# EAGLE design board (EAGLE 9.1.3)
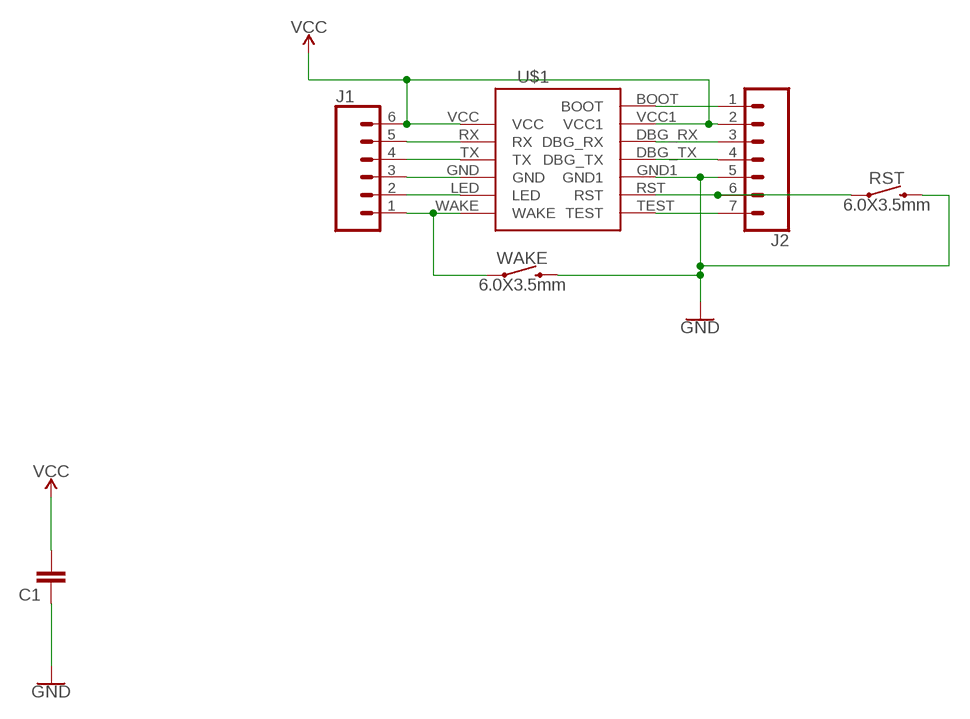
[diagram p0: schematic, sheet 1]

## Parts
C1  C-EUC0805  [C0805]
J1  CONN_06LOCK  [1X06_LOCK]
J2  CONN_07LOCK  [1X07_LOCK]
RST  6.0X3.5mm  MOMENTARY-SWITCH-SPST-SMD-6.0X3.5MM  [TACTILE_SWITCH_SMD_6.0X3.5MM]
U$1  IM-L400  [IM-L400]
WAKE  6.0X3.5mm  MOMENTARY-SWITCH-SPST-SMD-6.0X3.5MM  [TACTILE_SWITCH_SMD_6.0X3.5MM]

## Nets
GND [power]: C1.1 J1.3 J2.5 RST.2 U$1.GND U$1.GND1 WAKE.2
N$2: J1.5 U$1.RX
N$3: J1.4 U$1.TX
N$5: J1.2 U$1.LED
N$6: J1.1 U$1.WAKE WAKE.1
N$7: J2.1 U$1.BOOT
N$9: J2.3 U$1.DBG_RX
N$10: J2.4 U$1.DBG_TX
N$12: J2.6 RST.1 U$1.RST
N$13: J2.7 U$1.TEST
VCC [power]: C1.2 J1.6 J2.2 U$1.VCC U$1.VCC1

## Library data of the parts
C1 = rcl:C-EU: CAPACITOR, European symbol; SPICEPREFIX: C
J1 = SparkFun-Connectors:CONN_06: Multi connection point. Often used as Generic Header-pin footprint for 0.1 inch spaced/style header connections On any of the 0.1 inch spaced packages, you can populate with these: Break Away Headers - Straight <https://www.sparkfun.com/products/116> (PRT-00116) Break Away Male Headers - Right Angle <https://www.sparkfun.com/products/553> (PRT-00553) Female Headers <https://www.sparkfun.com/products/115> (PRT-00115) Break Away Headers - Machine Pin <https://www.sparkfun.com/products/117> (PRT-00117) Break Away Female Headers - Swiss Machine Pin <https://www.sparkfun.com/products/743> (PRT-00743) Arduino Stackable Header - 6 Pin <https://www.sparkfun.com/products/9280> (PRT-09280) For SCREWTERMINALS and SPRING TERMINALS visit here: Screw Terimnals on SparkFun.com <https://www.sparkfun.com/search/results?term=Screw+Terminals> (5mm/3.5mm/2.54mm spacing) This device is also useful as a general connection point to wire up your design to another part of your project. Our various solder wires solder well into these plated through hole pads. Hook-Up Wire - Assortment (Stranded, 22 AWG) <https://www.sparkfun.com/products/11375> (PRT-11375) Hook-Up Wire - Assortment (Solid Core, 22 AWG) <https://www.sparkfun.com/products/11367> (PRT-11367) View the entire wire category on our website here <https://www.sparkfun.com/categories/141>
J2 = SparkFun-Connectors:CONN_07: Multi connection point. Often used as Generic Header-pin footprint for 0.1 inch spaced/style header connections On any of the 0.1 inch spaced packages, you can populate with these: Break Away Headers - Straight <https://www.sparkfun.com/products/116> (PRT-00116) Break Away Male Headers - Right Angle <https://www.sparkfun.com/products/553> (PRT-00553) Female Headers <https://www.sparkfun.com/products/115> (PRT-00115) Break Away Headers - Machine Pin <https://www.sparkfun.com/products/117> (PRT-00117) Break Away Female Headers - Swiss Machine Pin <https://www.sparkfun.com/products/743> (PRT-00743) For SCREWTERMINALS and SPRING TERMINALS visit here: Screw Terimnals on SparkFun.com <https://www.sparkfun.com/search/results?term=Screw+Terminals> (5mm/3.5mm/2.54mm spacing) This device is also useful as a general connection point to wire up your design to another part of your project. Our various solder wires solder well into these plated through hole pads. Hook-Up Wire - Assortment (Stranded, 22 AWG) <https://www.sparkfun.com/products/11375> (PRT-11375) Hook-Up Wire - Assortment (Solid Core, 22 AWG) <https://www.sparkfun.com/products/11367> (PRT-11367) View the entire wire category on our website here <https://www.sparkfun.com/categories/141> Special notes: Molex polarized connector foot print use with SKU : PRT-08231 with associated crimp pins and housings. 1MM SMD Version SKU: PRT-10208 NOTES ON THE VARIANTS LOCK and LOCK_LONGPADS... This footprint was designed to help hold the alignment of a through-hole component (i.e. 6-pin header) while soldering it into place. You may notice that each hole has been shifted either up or down by 0.005 of an inch from it's more standard position (which is a perfectly straight line). This slight alteration caused the pins (the squares in the middle) to touch the edges of the holes. Because they are alternating, it causes a "brace" to hold the component in place. 0.005 has proven to be the perfect amount of "off-center" position when using our standard breakaway headers. Although looks a little odd when you look at the bare footprint, once you have a header in there, the alteration is very hard to notice. Also,if you push a header all the way into place, it is covered up entirely on the bottom side.
RST WAKE = SparkFun-Switches:MOMENTARY-SWITCH-SPST: Momentary Switch (Pushbutton) - SPST Normally-open (NO) SPST momentary switches (buttons, pushbuttons). Variants PTH-12MM - 12mm square, through-hole Momentary Pushbutton Switch - 12mm Square <https://www.sparkfun.com/products/9190> (COM-09190) PTH-6.0MM, PTH-6.0MM-KIT - 6.0mm square, through-hole Mini Pushbutton Switch <https://www.sparkfun.com/products/97> (COM-00097) KIT package intended for soldering kit's - only one side of pads' copper is exposed. PTH-RIGHT-ANGLE-KIT - Right-angle, through-hole Right Angle Tactile Button <https://www.sparkfun.com/products/10791> - Used on SparkFun BigTime Watch Kit <https://www.sparkfun.com/products/11734> SMD-12MM - 12mm square, surface-mount Tactile Button - SMD (12mm) <https://www.sparkfun.com/products/12993> (COM-12993) Used on SparkFun PicoBoard <https://www.sparkfun.com/products/11888> SMD-4.5MM - 4.5mm Square Trackball Switch Used on SparkFun Blackberry Trackballer Breakout <https://www.sparkfun.com/products/13169> SMD-4.6MMX2.8MM - 4.60mm x 2.80mm, surface mount Used on SparkFun SAMD21 Mini Breakout <https://www.sparkfun.com/products/13664> SMD-5.2MM, SMD-5.2-REDUNDANT - 5.2mm square, surface-mount Mini Pushbutton Switch - SMD <https://www.sparkfun.com/products/8720> (COM-08720) Used on Arduino Pro Mini <https://www.sparkfun.com/products/11114> REDUNDANT package connects both switch circuits together SMD-6.0X3.5MM - 6.0 x 3.5mm, surface mount Momentary Reset Switch SMD <https://www.sparkfun.com/products/8229> (COM-08229) SMD-6.2MM-TALL - 6.2mm square, surface mount Tactile Button - SMD (6mm) <https://www.sparkfun.com/products/12992> Used on SparkFun Digital Sandbox <https://www.sparkfun.com/products/12651> SMD-RIGHT-ANGLE - Right-angle, surface mount Used on SparkFun Block for Intel® Edison - Arduino <https://www.sparkfun.com/products/13036>; PROD_ID: SWCH-00815; SF_SKU: COM-08229
U$1 = Custom_LoRa:IM-L400: IM-L400 SX1276 based LoRa Module https://www.sktiot.com/iot/introduction/network/networkLoraMain3

## Net classes
0 default: width 0.406 mm
1 power: width 0.813 mm

## Board
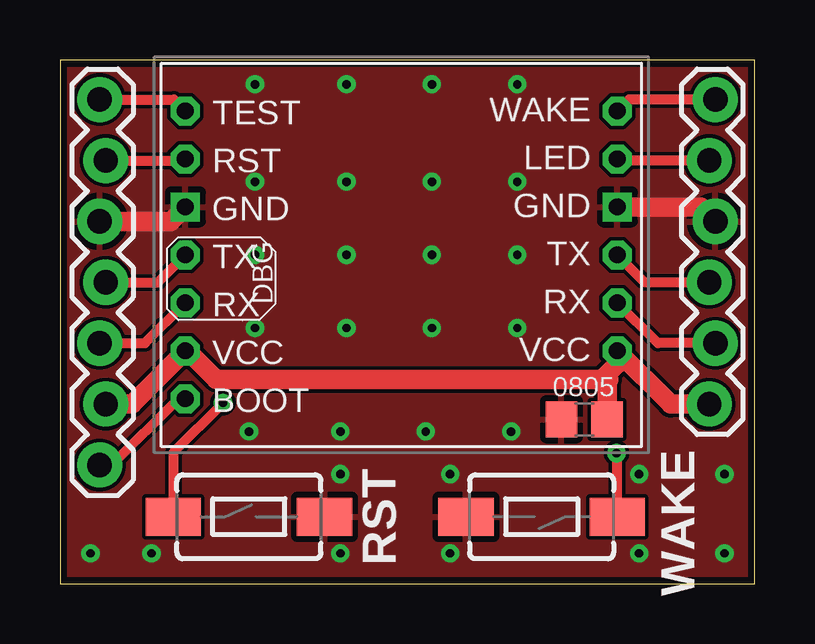
[diagram p1: board, top side]
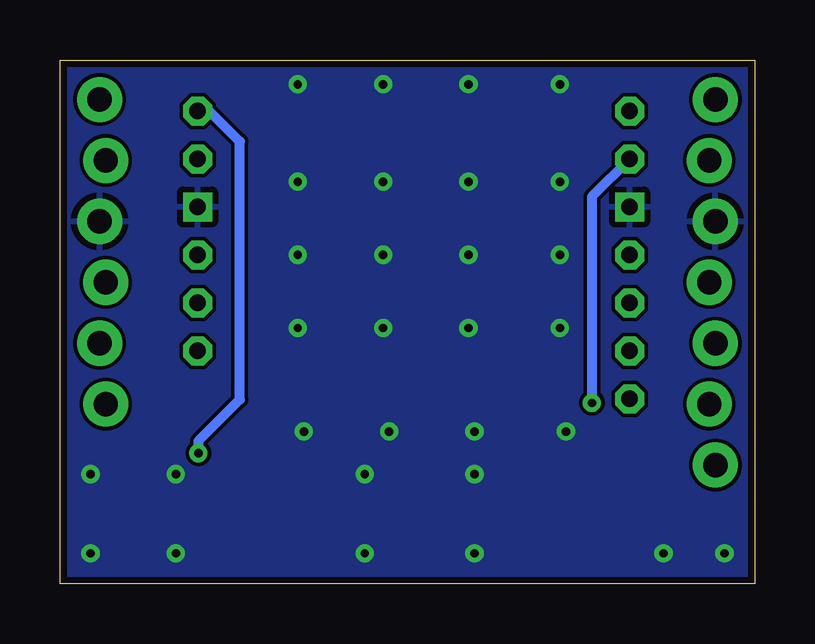
[diagram p2: board, bottom side, seen from below]

Size 28.96 x 21.84 mm. Coordinates in mm from the lower left corner, seen from the top.
Outline: 0,0 28.96,0 28.96,21.84 0,21.84 0,0
Copper layers (1*16): Top 0.035mm / dielectric 1.5mm / Bottom 0.035mm
Design rules "default *": minimum track width 6mil, minimum drill 0.35mm, track to track 6mil, track to pad 6mil, pad to pad 6mil, via to via 6mil, smd to smd 6mil, copper to edge 10mil, drill to drill 6mil, minimum pad ring 10mil, minimum via ring 8mil, stop-mask expansion 4mil, vias tented up to drill 0mil, thermal gap 10mil

### Footprints (pad centres in the part's own frame; a part is rotated, then mirrored left to right if it is on the bottom)
C0805 = smd 1.3 x 1.5: 1 -0.95,0; 2 0.95,0
1X06_LOCK = drill 1.016 pad 1.88: 1 0,0; 2 2.54,-0.254; 3 5.08,0; 4 7.62,-0.254; 5 10.16,0; 6 12.7,-0.254
1X07_LOCK = drill 1.016 pad 1.88: 1 0,0.127; 2 2.54,-0.127; 3 5.08,0.127; 4 7.62,-0.127; 5 10.16,0.127; 6 12.7,-0.127; 7 15.24,0.127
TACTILE_SWITCH_SMD_6.0X3.5MM = smd 2.3 x 1.6: 1 -3.15,0; 2 3.15,0
IM-L400 = drill 0.7 pad 1.2 octagon: BOOT 9,6; DBG_RX 9,2; DBG_TX 9,0; LED -9,-4; RST 9,-4; RX -9,2; TEST 9,-6; TX -9,0; VCC -9,4; VCC1 9,4; WAKE -9,-6 | drill 0.7 pad 1.2 square: GND -9,-2; GND1 9,-2

### Placement (x,y rotation side)
C1  21.84,6.86 0 top
J1  27.3,20.19 270 top
J2  1.78,4.95 90 top
RST  7.87,2.79 0 top
U$1  14.22,13.72 180 top
WAKE  20.07,2.79 180 top

### Tracks (layer width: path | path; a pad name or v marks a point on that pad's centre or on a via)
GND  (via drill 0.35)
  Top 0.813: J2.5 4.62,15.11 U$1.GND1 | J1.3 26.7,15.72 U$1.GND
  other vias: 8.13,20.83 11.94,20.83 15.49,20.83 19.05,20.83 8.13,16.76 11.94,16.76 15.49,16.76 19.05,16.76 8.13,10.67 11.94,10.67 15.49,10.67 19.05,10.67 7.87,6.35 11.68,6.35 15.24,6.35 18.8,6.35 8.13,13.72 11.94,13.72 15.49,13.72 19.05,13.72 3.81,1.27 11.68,1.27 16.26,1.27 27.69,1.27 1.27,1.27 24.13,1.27 11.68,4.57 16.26,4.57 27.69,4.57 24.13,4.57
  pour Top: -10.16,37.08 -10.16,-9.65 61.21,-9.65 61.21,37.08
  pour Bottom: -10.16,36.83 -10.16,-6.35 55.88,-6.35 55.88,36.83
N$2
  Top 0.406: J1.5 24.91,10.03 U$1.RX
N$3
  Top 0.406: J1.4 24.37,12.57 U$1.TX
N$5
  Top 0.406: J1.2 23.29,17.65 U$1.LED
N$6  (via drill 0.35)
  Top 0.406: J1.1 23.7,20.19 U$1.WAKE | v23.19,5.45 23.19,2.82 WAKE.1
  Bottom 0.406: v23.19,5.45 23.19,5.96 21.46,7.68 21.46,18.44 22.74,19.72 U$1.WAKE
N$7
  Top 0.406: U$1.BOOT 4.92,7.72 2.16,4.95 J2.1
N$9
  Top 0.406: J2.3 3.54,10.03 U$1.DBG_RX
N$10
  Top 0.406: J2.4 4.08,12.57 U$1.DBG_TX
N$12  (via drill 0.35)
  Top 0.406: J2.6 5.16,17.65 U$1.RST | v6.79,7.54 4.72,5.47 RST.1
  Bottom 0.406: U$1.RST 6.79,16.14 v6.79,7.54
N$13
  Top 0.406: J2.7 4.75,20.19 U$1.TEST
VCC
  Top 0.813: 22.58,8.52 6.51,8.52 5.32,9.72 U$1.VCC1 3,7.49 J2.2 | 22.58,8.52 22.86,8.52 | J1.6 25.45,7.49 U$1.VCC 23.22,9.16 22.58,8.52 | 22.58,8.52 22.79,8.31 C1.2

### Text on the board
tPlace: 0805